# Altium schematic sheet MasterShematic.SchDoc
size A
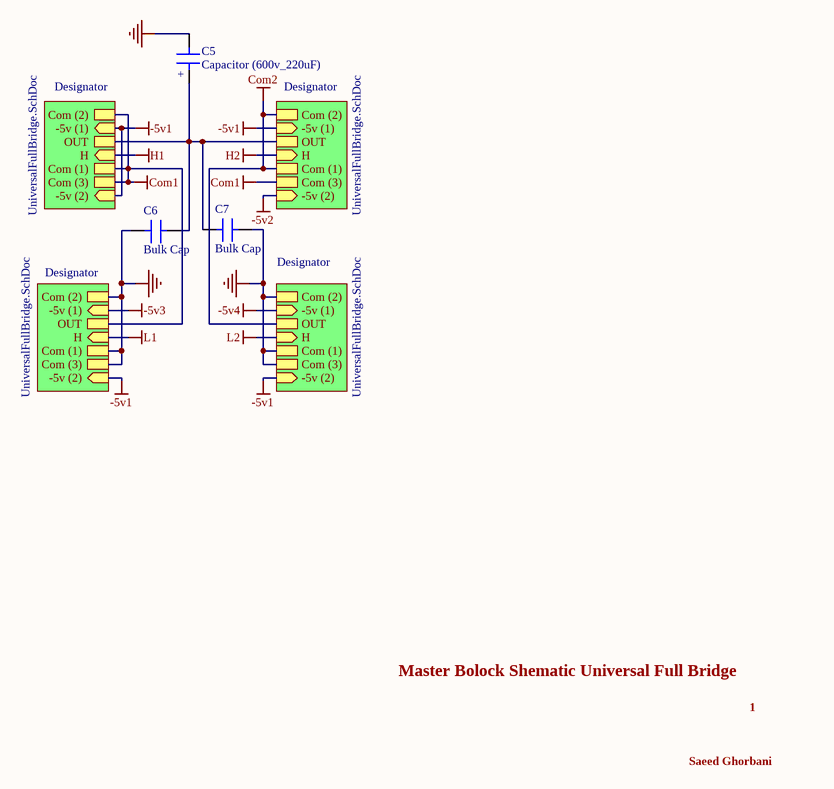
[diagram p0: MasterShematic.SchDoc]

## Parts
C5  Capacitor (600v_220uF)
C6  Bulk Cap
C7  Bulk Cap

## Sub-sheets
Designator = UniversalFullBridge.SchDoc: Com (2), -5v (1) (in), OUT, H (in), Com (1), Com (3), -5v (2) (in)
Designator = UniversalFullBridge.SchDoc: Com (2), -5v (1) (in), OUT, H (in), Com (1), Com (3), -5v (2) (in)
Designator = UniversalFullBridge.SchDoc: Com (2), -5v (1) (in), OUT, H (in), Com (1), Com (3), -5v (2) (in)
Designator = UniversalFullBridge.SchDoc: Com (2), -5v (1) (in), OUT, H (in), Com (1), Com (3), -5v (2) (in)

## Nets
-5v1: sheet Designator/-5v (1), sheet Designator/-5v (2), sheet Designator/-5v (1), sheet Designator/-5v (2), sheet Designator/-5v (2)
-5v2: sheet Designator/-5v (2)
-5v3: sheet Designator/-5v (1)
-5v4: sheet Designator/-5v (1)
Com1: sheet Designator/Com (2), sheet Designator/Com (1), sheet Designator/Com (3), sheet Designator/Com (3), sheet Designator/OUT
Com2: sheet Designator/Com (2), sheet Designator/Com (1), sheet Designator/OUT
GND: C5.2 C6.2 C7.1 ; sheet Designator/Com (2), sheet Designator/Com (1), sheet Designator/Com (3), sheet Designator/Com (2), sheet Designator/Com (1), sheet Designator/Com (3)
H1: sheet Designator/H
H2: sheet Designator/H
L1: sheet Designator/H
L2: sheet Designator/H
NetC5_1: C5.1 C6.1 C7.2 ; sheet Designator/OUT, sheet Designator/OUT

## Notes on the sheet
- Master Bolock Shematic Universal Full Bridge
- 1
- Saeed Ghorbani
- (in symbol Capacitor (600v_220uF)) +

## Library data of the parts
C6 C7 = Capcitor (3300pF Bulk)